# EAGLE design tlc-matrix-controller (EAGLE 5.10)
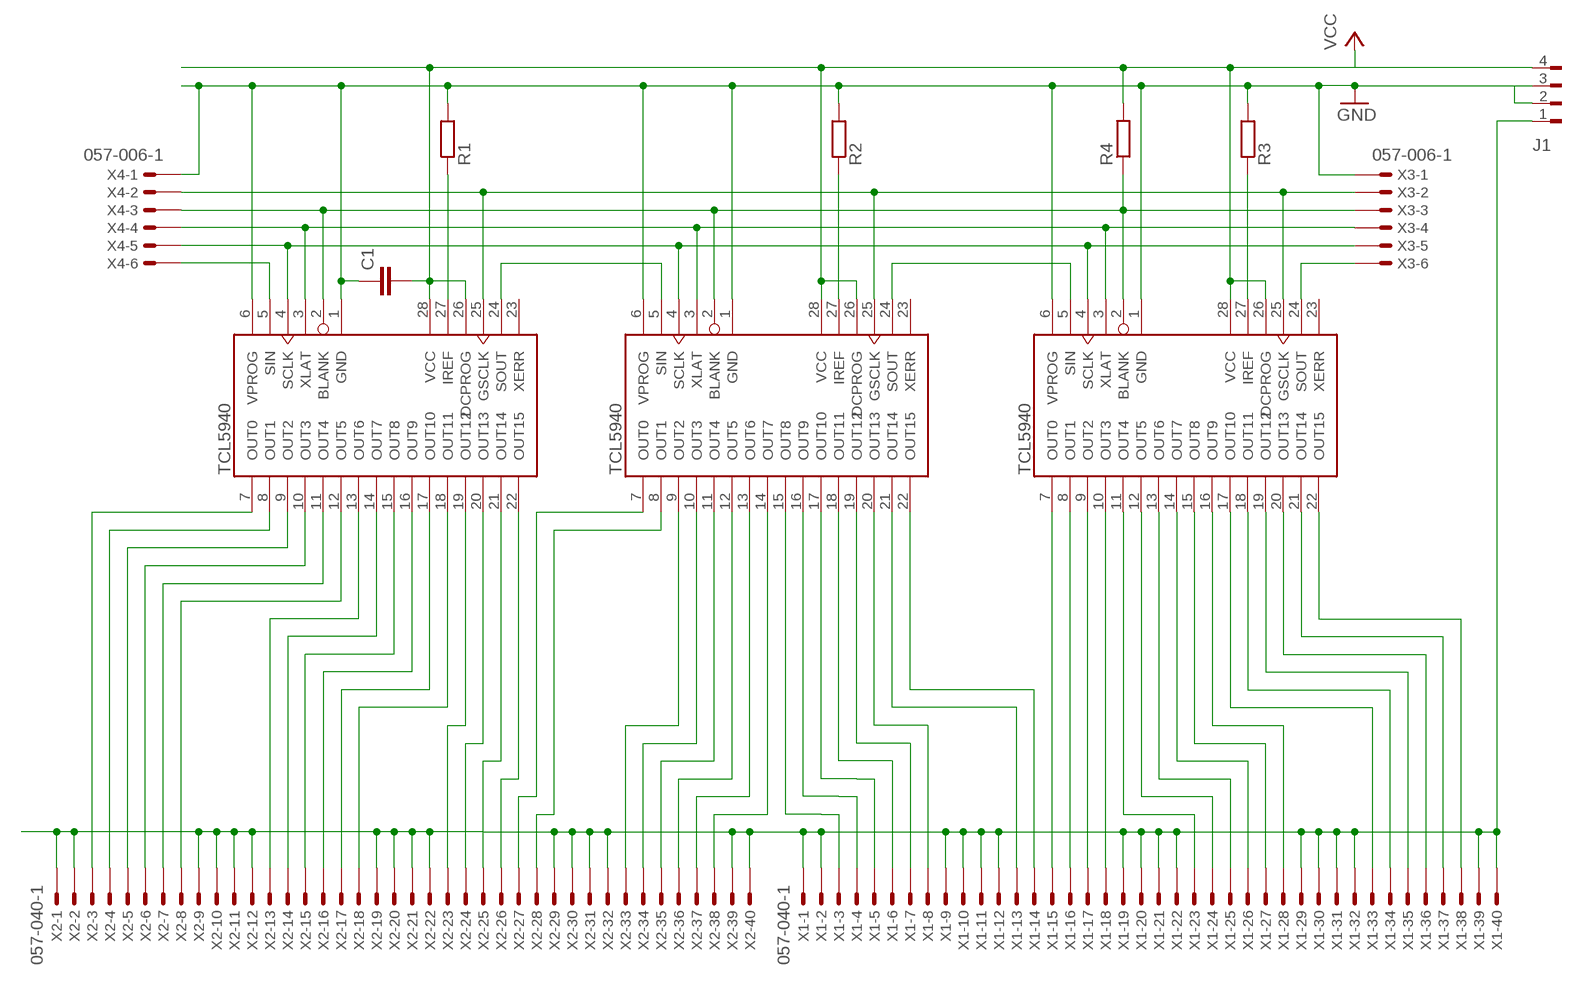
[diagram p0: schematic, sheet 1]

## Parts
C1  C-EU075-032X103  [C075-032X10-BIGPAD]
IC1  TCL5940  [PW_R-PDSO-G28]
IC2  TCL5940  [PW_R-PDSO-G28]
IC3  TCL5940  [PW_R-PDSO-G28]
J1  FLOPPY-4350211  [350211]
R1  R-EU_0207/10  [0207/10-BIGPAD]
R2  R-EU_0207/10  [0207/10-BIGPAD]
R3  R-EU_0207/10  [0207/10-BIGPAD]
R4  R-EU_0207/10  [0207/10-BIGPAD]
X1  057-040-1  [057-040-1]
X2  057-040-1  [057-040-1]
X3  057-006-1  [057-006-1]
X4  057-006-1  [057-006-1]

## Nets
N$2: IC1.5(SIN) X4.6
N$3: IC2.24(SOUT) IC3.5(SIN)
N$5: IC2.8(OUT1) X2.28
N$7: IC1.3(XLAT) IC2.3(XLAT) IC3.3(XLAT) X3.4 X4.4
N$8: IC1.8(OUT1) X2.4
N$9: IC1.27(IREF) R1.1
N$10: IC2.27(IREF) R2.1
N$11: IC3.27(IREF) R3.1
N$12: IC1.9(OUT2) X2.5
N$13: IC2.10(OUT3) X2.34
N$14: IC2.15(OUT8) X1.3
N$15: IC1.11(OUT4) X2.7
N$16: IC1.12(OUT5) X2.8
N$18: IC1.14(OUT7) X2.14
N$19: IC1.15(OUT8) X2.15
N$20: IC1.16(OUT9) X2.16
N$21: IC1.17(OUT10) X2.17
N$22: IC2.16(OUT9) X1.4
N$23: IC2.17(OUT10) X1.5
N$24: IC1.18(OUT11) X2.18
N$25: IC1.21(OUT14) X2.25
N$26: IC2.13(OUT6) X2.37
N$27: IC1.20(OUT13) X2.24
N$28: IC1.19(OUT12) X2.23
N$29: IC3.8(OUT1) X1.16
N$30: C1.2 IC1.26(DCPROG) IC1.28(VCC) IC2.26(DCPROG) IC2.28(VCC) IC3.26(DCPROG) IC3.28(VCC) J1.4 R4.2 ; supply symbol labelled VCC
N$31: IC2.9(OUT2) X2.33
N$33: IC2.11(OUT4) X2.35
N$34: IC2.12(OUT5) X2.36
N$35: IC3.9(OUT2) X1.17
N$36: IC2.14(OUT7) X2.38
N$37: IC2.18(OUT11) X1.6
N$38: IC2.19(OUT12) X1.7
N$39: IC2.20(OUT13) X1.8
N$40: IC2.21(OUT14) X1.13
N$41: IC3.10(OUT3) X1.18
N$42: IC2.22(OUT15) X1.14
N$43: IC1.22(OUT15) X2.26
N$44: IC1.2(BLANK) IC2.2(BLANK) IC3.2(BLANK) R4.1 X3.3 X4.3
N$45: IC2.7(OUT0) X2.27
N$46: IC3.7(OUT0) X1.15
N$47: IC3.11(OUT4) X1.23
N$48: IC3.12(OUT5) X1.24
N$49: IC3.13(OUT6) X1.25
N$50: IC3.14(OUT7) X1.26
N$51: IC3.15(OUT8) X1.27
N$53: IC3.17(OUT10) X1.33
N$55: IC3.19(OUT12) X1.35
N$56: IC3.20(OUT13) X1.36
N$57: IC3.21(OUT14) X1.37
N$58: IC3.22(OUT15) X1.38
N$59: C1.1 IC1.1(GND) IC1.6(VPROG) IC2.1(GND) IC2.6(VPROG) IC3.1(GND) IC3.6(VPROG) J1.2 J1.3 R1.2 R2.2 R3.2 X3.1 X4.1 ; supply symbol labelled GND
N$60: IC1.4(SCLK) IC2.4(SCLK) IC3.4(SCLK) X3.5 X4.5
N$64: IC1.24(SOUT) IC2.5(SIN)
N$67: J1.1 X1.1 X1.2 X1.9 X1.10 X1.11 X1.12 X1.19 X1.20 X1.21 X1.22 X1.29 X1.30 X1.31 X1.32 X1.39 X1.40 X2.1 X2.2 X2.9 X2.10 X2.11 X2.12 X2.19 X2.20 X2.21 X2.22 X2.29 X2.30 X2.31 X2.32 X2.39 X2.40
N$68: IC3.24(SOUT) X3.6
N$70: IC3.16(OUT9) X1.28
N$71: IC3.18(OUT11) X1.34
N$72: IC1.10(OUT3) X2.6
N$73: IC1.25(GSCLK) IC2.25(GSCLK) IC3.25(GSCLK) X3.2 X4.2
N$75: IC1.13(OUT6) X2.13
N$76: IC1.7(OUT0) X2.3
Unconnected: IC1.23(XERR) IC2.23(XERR) IC3.23(XERR)

## Library data of the parts
C1 = resistor:C-EU: CAPACITOR, European symbol
IC1-IC3 = tcl5940smd:TCL5940: 16-Channel 12-Bit LED Driver
J1 = con-amp:FLOPPY-4: MATE N-LOCK Floppy / HDD conector Distributor: Bürklin 71F970
R1-R4 = resistor:R-EU_: RESISTOR, European symbol
X1 X2 = con-panduit:057-040-: CONNECTOR 40-pin series 057 contact pc board low profile headers
X3 X4 = con-panduit:057-006-: CONNECTOR 6-pin series 057 contact pc board low profile headers

## Board
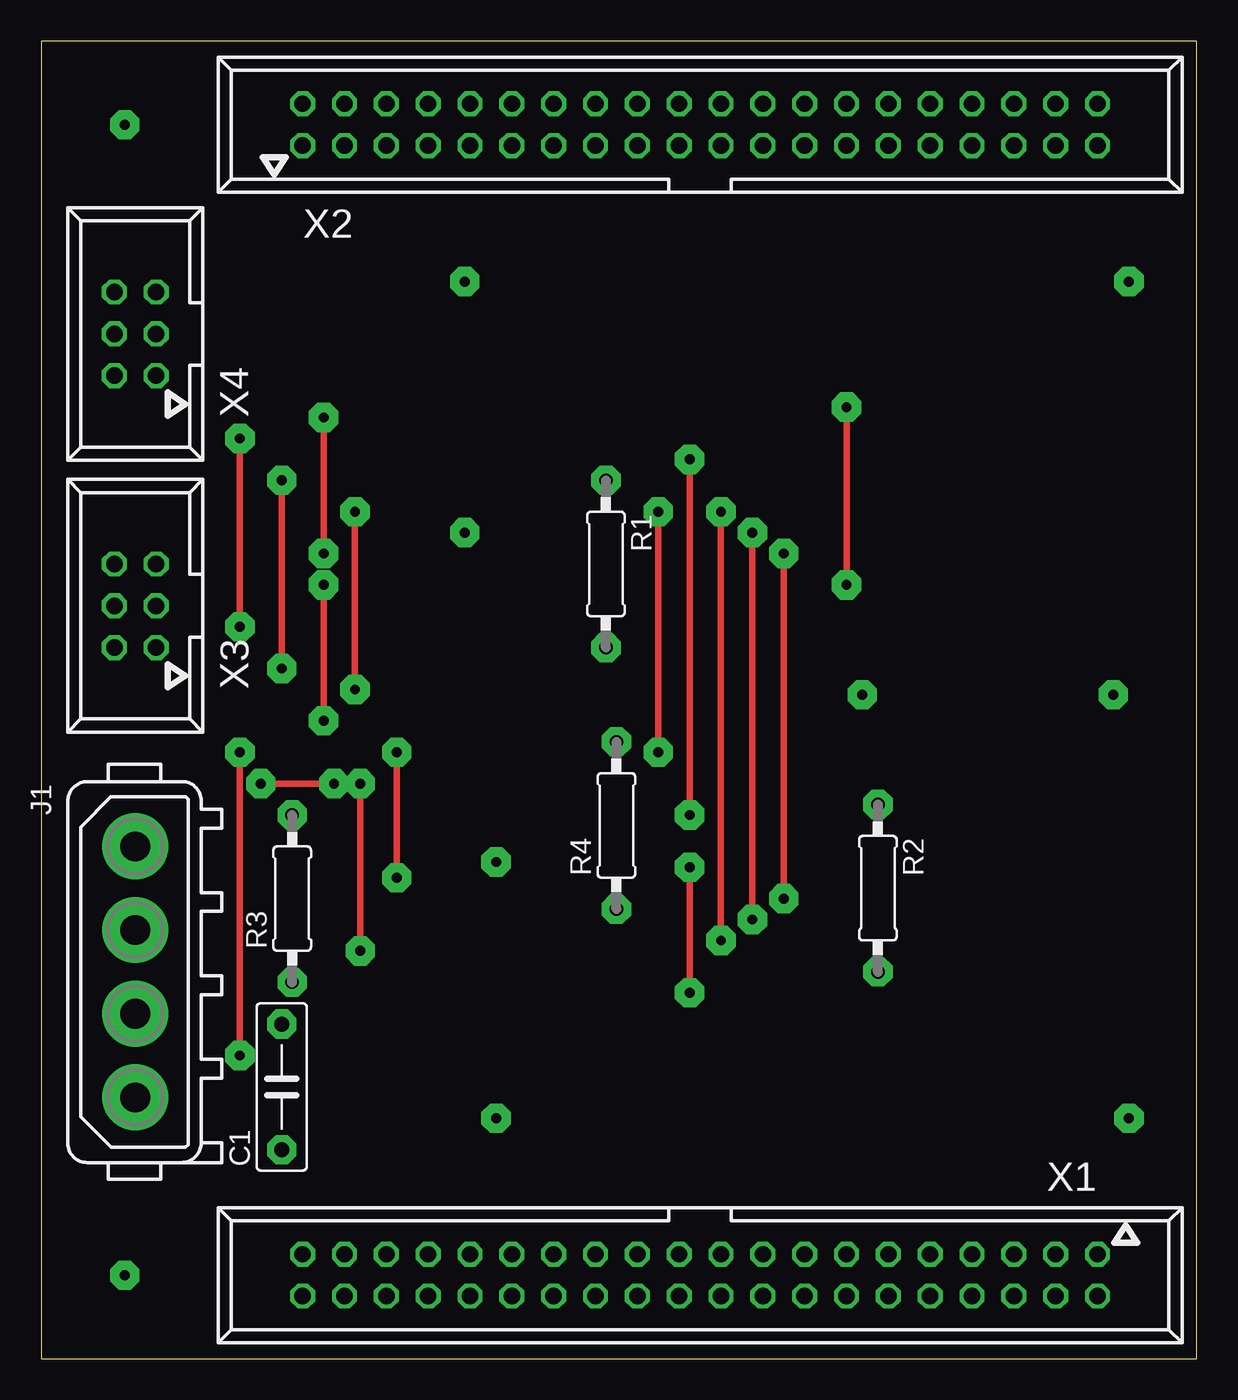
[diagram p1: board, top side]
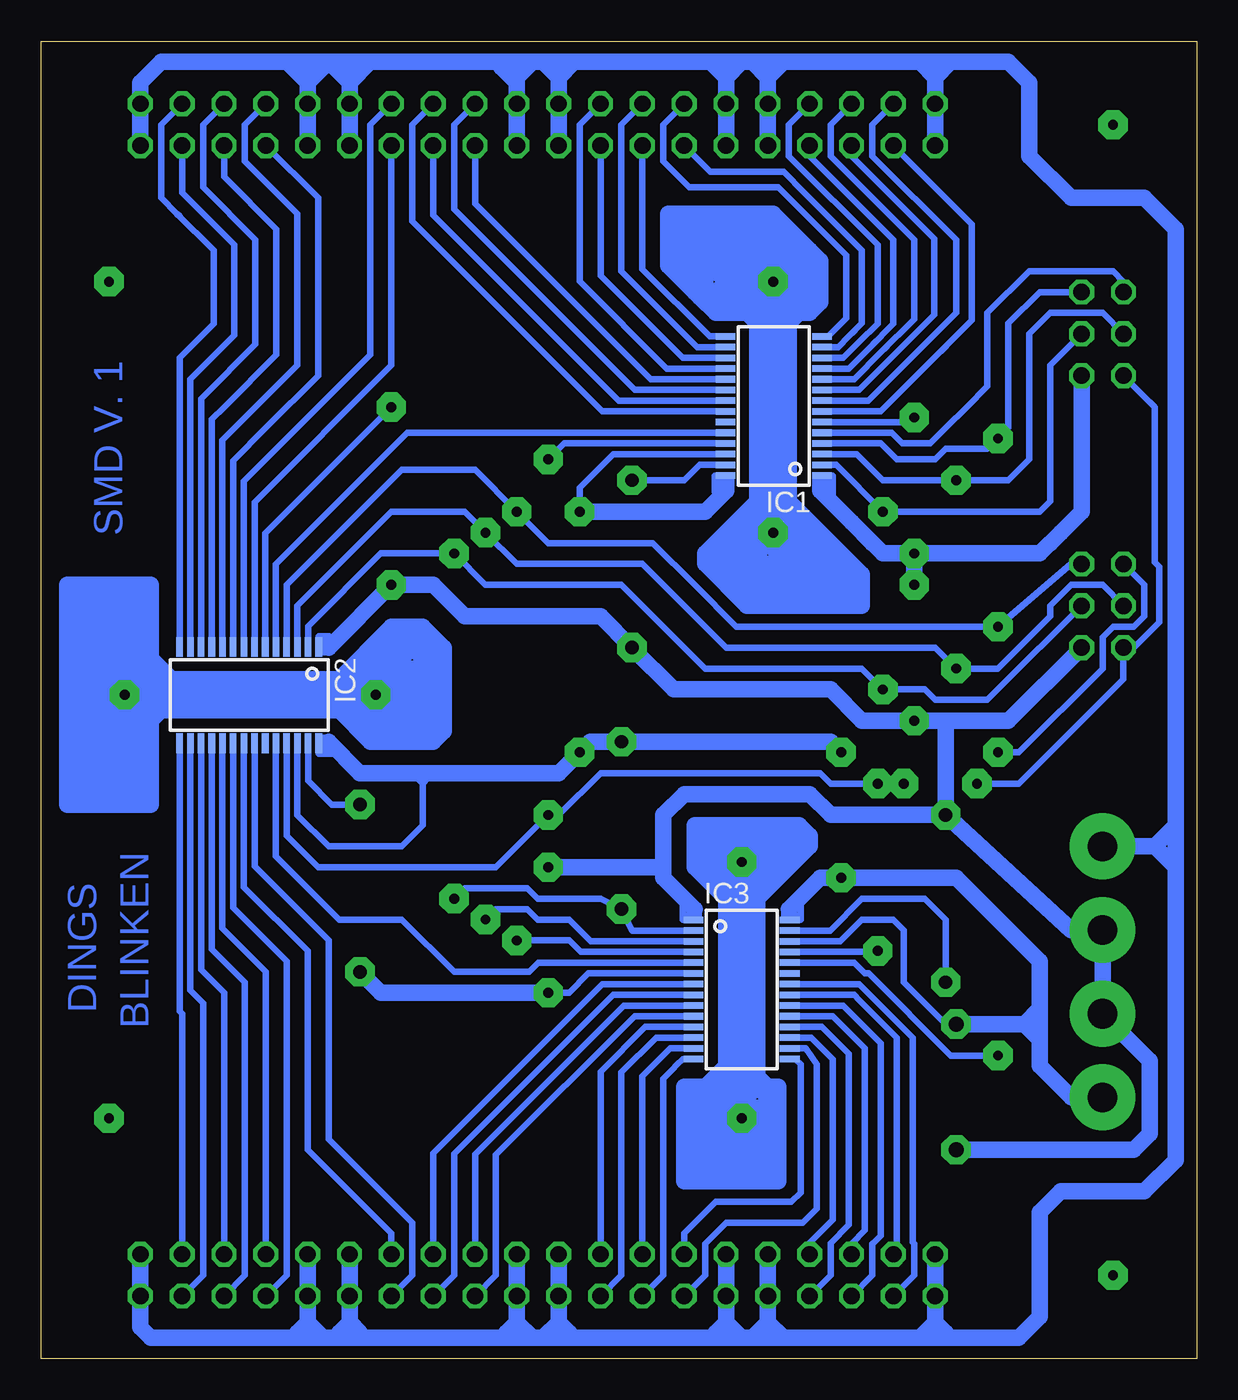
[diagram p2: board, bottom side, seen from below]

Size 70.16 x 80 mm. Coordinates in mm from the lower left corner, seen from the top.
Outline: 0,0 70.16,0 70.16,80 0,80 0,0
Copper layers (1*16): Top 0.035mm / dielectric 1.5mm / Bottom 0.035mm
Design rules "default": minimum track width 10mil, minimum drill 24mil, track to track 8mil, track to pad 8mil, pad to pad 8mil, via to via 8mil, smd to smd 8mil, copper to edge 40mil, drill to drill 8mil, minimum pad ring 10mil, minimum via ring 8mil, stop-mask expansion 4mil, vias tented up to drill 0mil, thermal gap 10mil

### Footprints (pad centres in the part's own frame; a part is rotated, then mirrored left to right if it is on the bottom)
C075-032X10-BIGPAD = drill 0.914 pad 1.778 octagon: 1 -3.81,0; 2 3.81,0
PW_R-PDSO-G28 = smd 0.4 x 1.2: 1 -4.225,-2.925; 2 -3.575,-2.925; 3 -2.925,-2.925; 4 -2.275,-2.925; 5 -1.625,-2.925; 6 -0.975,-2.925; 7 -0.325,-2.925; 8 0.325,-2.925; 9 0.975,-2.925; 10 1.625,-2.925; 11 2.275,-2.925; 12 2.925,-2.925; 13 3.575,-2.925; 14 4.225,-2.925; 15 4.225,2.925; 16 3.575,2.925; 17 2.925,2.925; 18 2.275,2.925; 19 1.625,2.925; 20 0.975,2.925; 21 0.325,2.925; 22 -0.325,2.925; 23 -0.975,2.925; 24 -1.625,2.925; 25 -2.275,2.925; 26 -2.925,2.925; 27 -3.575,2.925; 28 -4.225,2.925
350211 = drill 1.8 pad 4 round: 1 -7.62,0; 2 -2.54,0; 3 2.54,0; 4 7.62,0
0207/10-BIGPAD = drill 0.813 pad 1.778 octagon: 1 -5.08,0; 2 5.08,0
057-040-1 = drill 1 octagon: 1 -24.13,-1.27; 2 -24.13,1.27; 3 -21.59,-1.27; 4 -21.59,1.27; 5 -19.05,-1.27; 6 -19.05,1.27; 7 -16.51,-1.27; 8 -16.51,1.27; 9 -13.97,-1.27; 10 -13.97,1.27; 11 -11.43,-1.27; 12 -11.43,1.27; 13 -8.89,-1.27; 14 -8.89,1.27; 15 -6.35,-1.27; 16 -6.35,1.27; 17 -3.81,-1.27; 18 -3.81,1.27; 19 -1.27,-1.27; 20 -1.27,1.27; 21 1.27,-1.27; 22 1.27,1.27; 23 3.81,-1.27; 24 3.81,1.27; 25 6.35,-1.27; 26 6.35,1.27; 27 8.89,-1.27; 28 8.89,1.27; 29 11.43,-1.27; 30 11.43,1.27; 31 13.97,-1.27; 32 13.97,1.27; 33 16.51,-1.27; 34 16.51,1.27; 35 19.05,-1.27; 36 19.05,1.27; 37 21.59,-1.27; 38 21.59,1.27; 39 24.13,-1.27; 40 24.13,1.27
057-006-1 = drill 1 octagon: 1 -2.54,-1.27; 2 -2.54,1.27; 3 0,-1.27; 4 0,1.27; 5 2.54,-1.27; 6 2.54,1.27

### Placement (x,y rotation side)
C1  14.61,16.51 90 top
IC1  25.68,57.85 90 bottom
IC2  57.52,40.3 180 bottom
IC3  27.62,22.43 270 bottom
J1  5.71,23.5 270 top
R1  34.29,48.26 270 top
R2  50.8,28.57 270 top
R3  15.24,27.94 90 top
R4  34.92,32.38 90 top
X1  40.01,5.08 180 top
X2  40.01,74.93 0 top
X3  5.71,45.72 90 top
X4  5.71,62.23 90 top

### Tracks (layer width: path | path; a pad name or v marks a point on that pad's centre or on a via)
N$1
  Bottom 0.406: 29.25,52.65 29.25,53.62
N$2
  Bottom 0.406: 18.52,56.23 19.5,56.23 | 19.5,56.23 19.82,56.23 19.5,56.23 | 19.98,56.23 IC1.5 18.52,56.23 | X4.6 4.45,65.41 5.08,66.04 9.53,66.04 10.16,66.04 12.7,63.5 12.7,59.05 13.97,57.78 15.24,56.52 16.18,55.58 16.25,55.58 17.88,55.58 18.52,56.23
N$3
  Bottom 0.406: IC2.24 55.9,33.15 55.9,30.5 52.07,26.67 48.26,26.67 45.09,23.5 40.64,23.5 40.53,23.5 39.98,24.05 IC3.5
N$4
  Bottom 0.406: 22.1,52.98 22.1,53.62 | 22.1,52.98 22.1,52.65 22.1,52.98 | 22.1,52.98 22.1,53.22 22.23,53.34 22.23,52.7 | 22.1,52.98 22.1,52.33
N$5
  Bottom 0.406: X2.28 50.16,74.93 50.16,73.03 50.16,60.96 57.85,53.27 57.85,43.55 IC2.8
N$6
  Bottom 0.406: 53.3,42.9 52.65,42.9 52.65,43.55 53.3,43.55 53.3,43.88 52.65,43.88
N$7  (via drill 0.6 pad 1.78)
  Top 0.406: v43.18,50.16 v43.18,26.67 | v14.61,41.91 v14.61,53.34
  Bottom 0.406: X4.4 5.71,63.5 8.89,63.5 10.16,62.23 10.16,54.61 11.43,53.34 v14.61,53.34 19.05,53.34 20.64,54.92 IC1.3 | IC3.3 36.78,25.35 38.1,26.67 40.01,26.67 40.64,27.3 42.55,27.3 v43.18,26.67 | X3.4 5.71,46.99 7.62,46.99 8.89,45.72 8.89,45.09 12.06,41.91 v14.61,41.91 15.88,43.18 28.57,43.18 33.66,48.26 41.27,48.26 v43.18,50.16 44.45,51.44 48.9,51.44 54.6,45.73 IC2.3
N$8
  Bottom 0.406: X2.4 19.68,74.93 19.68,73.03 14.61,67.94 14.61,63.82 | 14.61,63.82 14.61,63.72 | IC1.8 19.93,58.17 14.61,63.5 14.61,63.82
N$9
  Bottom 0.406: IC1.27 30.18,54.27 31.11,53.34 R1.1
N$10
  Bottom 0.406: IC2.27 53.95,35.1 52.51,33.66 R2.1
N$11
  Bottom 0.406: IC3.27 23.53,26 IC3.27 | 16.51,27.94 15.88,27.3 | 16.51,27.94 20.32,27.94 22.26,26 IC3.27 | R3.1 15.24,26.67 16.51,27.94
N$12
  Bottom 0.406: 20.8,58.83 IC1.9 | 20.8,58.83 20.55,58.83 | X2.5 20.95,73.03 19.37,71.44 16.19,68.26 15.93,68 15.93,63.38 20.48,58.83 20.8,58.83
N$13
  Bottom 0.406: 58.1,56.83 59.15,55.78 59.15,43.55 IC2.10 | 58.1,56.83 57.78,57.15 | X2.34 57.78,74.93 57.78,73.03 57.78,72.71 54.61,69.53 54.61,60.33 58.1,56.83
N$14
  Bottom 0.406: IC2.15 61.75,21.11 61.59,20.95 X1.3
N$15
  Bottom 0.406: IC1.11 21.12,60.12 19.82,61.42 | 19.82,61.42 19.5,61.75 | X2.7 23.5,73.03 18.41,67.94 18.41,62.84 19.82,61.42
N$16
  Bottom 0.406: X2.8 24.77,74.93 24.77,73.03 19.37,67.63 19.37,62.86 20.48,61.75 | IC1.12 21.45,60.77 20.48,61.75 | 20.48,61.75 20.15,62.08
N$17
  Bottom 1.016: 26.67,19.05 26.67,26.04 | 26.67,19.05 26.67,27.94 23.5,31.11 23.5,31.75 24.13,32.38 30.48,32.38 30.48,29.84 28.57,27.94 28.57,19.05 | 28.57,19.05 27.94,19.68 27.94,28.57 29.21,29.84 29.84,29.84 29.84,31.75 24.13,31.75 27.3,28.57 29.21,30.48 29.21,31.11 25.4,31.11 27.3,29.21 28.57,30.48 27.3,30.48 26.67,30.48 27.3,29.84 27.3,19.68 | 26.67,19.05 26.67,17.14 26.04,16.51 25.4,16.51 25.4,10.79 31.11,10.79 31.11,16.51 29.84,16.51 28.57,17.78 28.57,19.05 | 28.57,19.05 27.3,19.05 27.3,15.88 26.67,16.51 26.04,15.88 26.04,11.43 30.48,11.43 30.48,15.88 29.21,15.88 27.94,17.14 27.94,17.78 27.94,18.41 27.94,12.06 29.84,12.06 29.84,15.24 28.57,15.24 28.57,13.97 29.21,13.34 29.21,12.7
N$18
  Bottom 0.406: X2.14 32.38,74.93 32.38,73.03 32.38,72.71 30.8,71.12 25.4,71.12 21.27,66.99 21.27,63.5 | 22.38,62.08 IC1.14 22.38,62.08 | 21.27,63.5 21.27,63.23 | 22.38,62.08 21.27,63.18 21.27,63.5
N$19
  Bottom 0.406: X2.15 33.66,66.16 29.57,62.08 IC1.15
N$20
  Bottom 0.406: X2.16 34.92,74.93 34.92,73.03 34.92,66.04 30.31,61.42 IC1.16
N$21
  Bottom 0.406: X2.17 36.2,65.77 31.2,60.77 IC1.17
N$22
  Bottom 0.406: X1.4 60.33,5.08 60.33,6.99 60.33,21.59 61.1,22.36 IC2.16
N$23
  Bottom 0.406: IC2.17 60.45,23.62 59.05,22.23 X1.5
N$24
  Bottom 0.406: X2.18 37.47,74.93 37.47,73.03 37.47,65.42 32.17,60.12 IC1.18
N$25
  Bottom 0.406: X2.25 46.35,69.43 35.1,58.17 IC1.21
N$26
  Bottom 0.406: IC2.13 61.1,59.48 58.42,62.16 58.42,67.63 61.59,70.8 X2.37 61.59,72.39
N$27
  Bottom 0.406: X2.24 45.09,74.93 45.09,73.03 45.09,69.78 34.12,58.83 IC1.20
N$28
  Bottom 0.406: X2.23 43.81,70.14 33.15,59.48 IC1.19
N$29
  Bottom 0.406: X1.16 45.09,5.08 45.09,6.99 45.09,12.44 35.42,22.1 IC3.8
N$30  (via drill 0.6 pad 1.78)
  Top 0.406: v37.47,36.83 v37.47,51.44 | v21.59,29.21 v21.59,36.83
  Bottom 0.406: 54.6,34.45 54.6,33.01 52.7,31.11 48.26,31.11 46.99,32.38 46.99,34.92 | 54.6,34.45 54.6,34.77 | 28.6,53.37 IC1.28 28.6,53.37 | 28.6,53.37 28.57,53.34 28.6,53.37 | IC1.26 35.42,54.92 37.47,52.88 v37.47,51.44 | IC3.26 21.64,25.35 20.32,26.67 18.41,26.67 17.78,26.04 17.78,25.72 17.78,22.86 15.24,20.32 C1.2 | IC3.28 24.7,27.24 24.77,27.3 | IC2.28 52.8,37.38 52.7,37.47 | 54.6,35.75 54.6,34.91 | 54.6,35.75 IC2.26 | 53.3,37.7 52.94,37.7 52.7,37.47 | 52.7,37.47 52.7,37.1 52.65,37.05 53.3,37.05 53.3,36.73 52.33,36.73 | 46.99,35.56 46.99,34.92 | 54.6,34.45 54.6,35.75 | 46.99,34.92 47.31,35.24 46.99,34.92 | 46.99,34.92 46.67,35.24
  Bottom 1.016: 24.77,27.3 22.86,29.21 v21.59,29.21 | v21.59,29.21 20.95,29.21 v21.59,29.21 | 52.7,37.47 50.8,35.56 46.99,35.56 45.72,35.56 38.73,35.56 | 28.57,53.34 28.57,52.7 29.84,51.44 v37.47,51.44 | v37.47,36.83 38.73,35.56 | J1.4 7.62,15.88 9.53,17.78 9.53,19.37 | v21.59,29.21 14.61,29.21 9.53,24.13 9.53,21.27 | 9.53,19.37 9.53,20.32 | 9.53,20.32 9.53,21.27 | 9.53,20.32 10.48,20.32 | 10.48,20.32 C1.2 | v37.47,36.83 38.73,35.56 | v37.47,36.83 36.83,37.47 R4.2 22.23,37.47 v21.59,36.83 | 10.48,20.32 9.53,21.27 | 9.53,19.37 10.48,20.32
N$31
  Bottom 0.406: IC2.9 58.5,54.53 56.52,56.52 53.34,59.69 53.34,70.48 X2.33
N$32
  Bottom 1.016: 29.21,13.97 28.57,14.61 28.57,15.88 29.21,15.24 29.21,14.61 28.57,13.97 28.57,12.7 27.94,12.06 27.3,12.06 26.67,12.06 26.67,15.24 27.3,15.24 27.3,13.34 27.3,12.7
N$33
  Bottom 0.406: IC2.11 59.8,57.04 59.05,57.78 55.88,60.96 55.88,68.58 59.05,71.75 X2.35
N$34
  Bottom 0.406: X2.36 60.33,74.93 60.33,73.03 60.33,71.44 60.33,71.12 57.15,67.94 57.15,61.59 60.33,58.42 60.45,58.3 IC2.12
N$35
  Bottom 0.406: X1.17 43.81,12.41 34.77,21.45 IC3.9
N$36
  Bottom 0.406: X2.38 62.87,74.93 62.87,73.03 62.87,70.48 61.91,69.53 | IC2.14 61.75,60.77 59.69,62.84 59.69,67.31 61.91,69.53 | 61.91,69.53 61.75,69.37
N$37
  Bottom 0.406: X1.6 57.78,5.08 57.78,6.99 57.78,22.86 59.8,24.88 IC2.18
N$38
  Bottom 0.406: IC2.19 59.15,26.13 56.52,23.5 X1.7
N$39
  Bottom 0.406: X1.8 55.24,5.08 55.24,6.99 55.24,24.13 58.5,27.39 IC2.20
N$40
  Bottom 0.406: IC2.21 57.85,28.64 53.98,24.77 53.98,12.7 48.9,7.62 X1.13
N$41
  Bottom 0.406: X1.18 42.55,5.08 42.55,6.99 42.55,12.38 34.12,20.8 IC3.10
N$42
  Bottom 0.406: X1.14 47.62,5.08 47.62,6.99 47.62,8.26 52.7,13.34 52.7,25.4 57.2,29.89 IC2.22
N$43
  Bottom 0.406: X2.26 47.62,74.93 47.62,73.03 47.62,69.08 36.08,57.52 IC1.22
N$44  (via drill 0.6 pad 1.78)
  Top 0.406: v45.09,48.9 v45.09,27.94 | v19.05,40.64 v19.05,51.44
  Bottom 0.406: 38.73,27.94 39.37,27.94 40.01,27.94 40.64,28.57 44.45,28.57 v45.09,27.94 | 38.73,27.94 38.1,27.94 | X4.3 8.89,60.33 8.89,55.88 8.89,55.24 8.89,52.07 9.53,51.44 v19.05,51.44 21.89,54.27 IC1.2 | X3.3 12.06,40.64 12.7,40.01 15.88,40.01 16.51,40.64 v19.05,40.64 20.32,41.91 29.84,41.91 34.92,46.99 43.18,46.99 v45.09,48.9 49.53,48.9 53.95,44.48 IC2.2 | IC3.2 34.26,26 R4.1 36.2,27.94 38.73,27.94
N$45
  Bottom 0.406: IC2.7 57.2,52.02 48.9,60.33 X2.27
N$46
  Bottom 0.406: X1.15 46.35,12.47 36.08,22.75 IC3.7
N$47
  Bottom 0.406: X1.23 36.2,17.43 33.48,20.15 IC3.11
N$48
  Bottom 0.406: X1.24 34.92,5.08 34.92,6.99 34.92,17.4 32.83,19.5 IC3.12
N$49
  Bottom 0.406: IC3.13 31.95,18.85 33.66,17.14 X1.25
N$50
  Bottom 0.406: X1.26 32.38,5.08 32.38,6.99 32.38,9.53 32.38,17.02 32.17,17.23 31.85,17.55 31.52,17.88 31.2,18.2 IC3.14
N$51
  Bottom 0.406: IC3.15 24.38,18.2 24.05,17.88 24.05,11.38 24.05,10.07 24.6,9.53 29.21,9.53 31.11,7.62 X1.27
N$52  (via drill 0.6 pad 1.78)
  Bottom 1.016: 24.77,62.23 24.77,52.07 20.32,47.62 20.32,45.72 27.3,45.72 29.84,48.26 29.84,48.9 26.67,52.07 26.67,57.78 | 26.04,57.78 26.67,57.78 | 26.04,57.78 25.4,57.78 25.4,51.44 20.95,46.99 20.95,46.35 21.59,46.35 | 21.59,46.35 27.3,46.35 29.21,48.26 26.04,51.44 | 26.04,51.44 22.23,47.62 | 22.23,47.62 22.23,46.99 26.67,46.99 27.94,48.26 28.57,48.26 26.67,50.16 26.04,50.16 23.5,47.62 24.13,47.62 | 24.13,47.62 26.04,47.62 26.67,48.26 27.3,48.26 26.67,48.9 26.04,49.53 25.4,48.9 25.4,48.26 26.04,48.26 25.4,47.62 24.13,47.62 | 24.13,47.62 22.23,47.62 | 26.04,51.44 22.23,47.62 | 26.04,51.44 26.04,52.07 26.04,57.15 | 26.67,57.78 26.67,62.87 | 26.67,62.87 27.3,63.5 28.57,63.5 29.21,63.5 30.16,64.45 | 30.16,64.45 30.48,64.77 30.48,67.31 23.5,67.31 22.86,66.67 | 22.86,66.67 22.86,64.14 23.5,63.5 24.13,63.5 24.77,62.87 | 24.77,62.87 24.77,62.23 | 24.77,62.23 25.4,61.59 25.4,58.42 26.04,59.05 26.04,62.23 26.67,62.87 | 26.67,63.5 26.67,62.87 | 26.67,63.5 26.67,64.14 29.21,64.14 29.84,64.77 29.84,65.41 29.84,66.67 23.5,66.67 23.5,64.14 24.77,62.87 | 25.4,62.87 24.77,62.87 | 25.4,62.87 25.4,62.23 26.67,63.5 | 26.04,64.14 26.67,63.5 | 26.04,64.14 26.04,64.77 | 26.04,64.77 27.3,64.77 27.94,65.41 28.57,65.41 29.21,64.77 27.94,64.77 29.21,66.04 24.13,66.04 24.13,64.14 25.4,62.87 | 25.4,62.87 26.04,63.5 24.77,64.77 | 24.77,64.77 24.77,65.41 v25.72,65.41 | v25.72,65.41 26.67,65.41 26.04,64.77 | 26.04,64.14 26.04,64.77 | 26.04,64.14 25.4,64.77 24.77,64.77 | 24.77,64.77 25.4,65.41 v25.72,65.41 | v25.72,65.41 27.3,65.41 26.04,64.14 | 26.04,57.78 26.04,64.14 | 24.13,47.62 24.77,48.26 | 24.13,47.62 22.86,46.35 21.59,46.35
  Bottom 1.016: 21.59,46.35 21.59,46.99 | 22.86,66.67 25.72,69.53 32.07,69.53 32.07,66.36 30.16,64.45
N$53
  Bottom 0.406: IC3.17 23.4,19.5 22.1,18.2 22.1,11.38 22.1,8.45 23.5,7.05 X1.33
N$54
  Bottom 1.016: 54.61,41.27 55.24,41.27 | 54.61,41.27 52.07,41.27 48.9,44.45 46.99,44.45 45.72,43.18 45.72,38.1 46.35,37.47 50.16,37.47 52.07,39.37 52.7,39.37 60.33,39.37 | 60.33,39.37 60.33,41.27 59.05,41.27 | 59.05,41.27 54.61,41.27 | 54.61,41.27 50.8,41.27 48.26,43.81 46.99,43.81 46.35,43.18 46.35,38.1 50.16,38.1 50.8,38.73 | 50.8,38.73 51.44,39.37 51.44,40.64 50.16,40.64 47.62,43.18 46.99,42.55 46.99,38.73 50.8,38.73 | 50.8,38.73 50.8,39.37 50.16,40.01 50.8,40.01 48.9,41.91 47.62,41.91 47.62,39.37 50.16,39.37 48.9,40.64 48.26,41.27 48.26,40.01 48.9,40.01 59.69,40.01 59.69,40.64 52.07,40.64 | 59.05,41.27 62.23,41.27 63.5,42.55 63.5,43.18 63.5,46.35 | 63.5,46.35 64.14,46.99 65.41,46.99 | 65.41,46.99 68.58,46.99 68.58,34.29 68.58,33.66 63.5,33.66 63.5,34.29 63.5,38.73 62.87,39.37 62.23,39.37 60.33,39.37 | 60.33,39.37 60.96,40.01 60.96,40.64 | 63.5,46.35 63.5,46.99 65.41,46.99
N$55
  Bottom 0.406: IC3.19 22.1,20.8 21.45,20.15 20.15,18.85 20.15,11.38 20.15,7.8 20.95,7 X1.35
N$56
  Bottom 0.406: IC3.20 21.45,21.45 19.18,19.18 19.18,11.38 19.18,7.47 19.66,6.99 19.68,6.99 19.68,5.08 X1.36
N$57
  Bottom 0.406: IC3.21 20.8,22.1 20.48,21.77 18.2,19.5 18.2,15.93 18.2,6.83 18.41,6.61 X1.37
N$58
  Bottom 0.406: IC3.22 20.48,22.75 17.23,19.5 17.23,16.9 17.23,10.4 17.23,7.07 17.14,6.99 17.14,5.08 X1.38
N$59  (via drill 0.6 pad 1.78)
  Top 0.406: v17.14,48.9 v17.14,57.15 | v17.14,38.73 v17.14,46.99 | v39.37,29.84 v39.37,22.23 | v48.9,46.99 v48.9,57.78
  Bottom 0.406: 17.55,56.88 19.18,56.88 | 19.18,56.88 IC1.6 | IC1.1 22.75,53.45 22.86,53.34 | IC3.1 30.55,27.23 30.48,27.3 | IC3.6 36.73,23.4 36.92,23.4 38.1,22.23 v39.37,22.23 49.53,22.23 R2.2 | IC2.6 56.55,50.13 v48.9,57.78 | IC2.1 52.75,43.23 52.7,43.18 | 17.55,56.88 19.18,56.88 | 17.55,56.88 17.27,57.15 v17.14,57.15
  Bottom 1.016: 30.48,27.3 32.38,29.21 32.38,29.84 | 32.38,29.84 32.38,33.02 31.11,34.29 23.5,34.29 22.23,33.02 R3.2 | 52.7,43.18 v48.9,46.99 46.35,46.99 44.45,45.09 36.2,45.09 R1.2 31.75,40.64 22.23,40.64 20.32,38.73 v17.14,38.73 15.24,38.73 | X4.1 6.99,51.44 8.26,50.16 | 8.26,50.16 8.89,49.53 | 22.86,53.34 22.86,52.7 20.95,50.8 | 20.95,50.8 19.68,49.53 | X3.1 11.43,38.73 15.24,38.73 | v17.14,46.99 v17.14,48.9 | C1.1 3.81,12.7 2.86,13.65 2.86,18.1 J1.3 J1.2 7.62,26.04 R3.2 | 32.38,29.84 v39.37,29.84 | R3.2 15.24,38.73 | v17.14,48.9 9.53,48.9 8.26,50.16 | v17.14,48.9 19.05,48.9 20.95,50.8 | v39.37,22.23 49.53,22.23 R2.2
N$60  (via drill 0.6 pad 1.78)
  Top 0.406: v41.27,51.44 v41.27,25.4 | v12.06,44.45 v12.06,55.88
  Bottom 0.406: IC3.4 37.4,24.7 38.1,25.4 v41.27,25.4 | 19.5,55.58 19.36,55.58 | 19.5,55.58 IC1.4 | X4.5 9.53,64.77 11.43,62.87 11.43,56.52 v12.06,55.88 12.7,55.24 13.34,55.24 15.24,55.24 15.88,54.61 17.78,54.61 18.21,54.61 19.18,55.58 19.5,55.58 | X3.5 7.62,48.26 v12.06,44.45 27.94,44.45 30.48,46.99 33.02,49.53 39.37,49.53 v41.27,51.44 43.81,53.98 48.26,53.98 50.8,51.44 55.25,46.98 IC2.4
N$61
  Bottom 0.406: 30.23,26.65 30.23,27.3
N$62
  Bottom 0.406: 30.88,26.65 30.88,26.98
N$63
  Bottom 0.406: 31.2,26.65 31.2,27.3 31.2,27.62
N$64
  Bottom 0.406: IC1.24 31.2,56.23 | 31.2,56.23 31.46,56.23 | IC2.5 55.9,48.24 48.26,55.88 47.91,56.23 31.52,56.23 31.2,56.23
N$65
  Bottom 1.016: 61.59,40.64 67.94,40.64 67.94,40.01 61.59,40.01
N$66
  Bottom 1.016: 64.14,38.73 64.14,39.37 | 64.14,38.73 63.5,39.37 64.14,38.73 | 64.14,34.92 64.14,38.73 | 64.14,34.92 64.14,34.29 67.94,34.29 67.94,46.35 64.14,46.35 64.14,45.72 | 64.14,45.72 64.14,34.92 | 64.14,34.92 63.5,35.56 63.5,41.27 67.31,41.27 67.31,45.72 64.14,45.72 | 64.77,45.09 64.14,45.72 | 64.77,45.09 65.41,44.45 65.41,34.92 64.77,34.92 64.77,45.09 | 64.77,45.09 66.67,45.09 67.31,44.45 67.31,34.92 66.67,34.92 | 66.67,34.92 66.04,34.92 66.04,44.45 66.67,44.45 66.67,34.92
N$67
  Bottom 0.406: X1.40 X1.39
  Bottom 1.016: 1.27,32.38 2.54,31.11 | 1.27,32.38 1.27,68.58 3.17,70.48 7.62,70.48 10.16,73.03 10.16,77.47 11.43,78.74 14.92,78.74 | 14.92,78.74 15.88,78.74 | 15.88,78.74 16.83,78.74 | 16.83,78.74 25.08,78.74 | 25.08,78.74 26.04,78.74 | 26.04,78.74 26.99,78.74 | 26.99,78.74 27.62,78.74 | 27.62,78.74 28.57,78.74 | 28.57,78.74 29.53,78.74 | 29.53,78.74 37.78,78.74 | 37.78,78.74 38.73,78.74 | 38.73,78.74 39.69,78.74 | 39.69,78.74 40.32,78.74 | 40.32,78.74 41.27,78.74 | 41.27,78.74 50.16,78.74 | 50.16,78.74 51.44,78.74 | 51.44,78.74 52.7,78.74 | 52.7,78.74 53.98,78.74 | 28.57,78.74 28.57,77.79 | 28.57,77.79 X2.12 X2.11 | X2.19 X2.20 38.73,77.47 | 51.44,77.47 X2.30 X2.29 51.44,77.47 | 51.44,77.47 51.44,78.11 | X2.39 X2.40 64.14,77.47 62.87,78.74 55.24,78.74 | 53.98,78.74 55.24,78.74 | 15.88,78.74 15.88,77.79 | 15.88,77.79 X2.2 X2.1 | 26.04,78.74 26.04,77.79 | 26.04,77.79 X2.10 X2.9 | 41.27,78.74 41.27,78.11 41.27,77.79 | X2.21 X2.22 41.27,77.47 | 38.73,78.74 38.73,77.79 | 38.73,77.79 38.73,77.47 | 41.27,77.79 41.27,77.47 | 53.98,77.47 X2.32 X2.31 53.98,77.47 | 53.98,77.47 53.98,78.11 | 53.98,78.74 53.98,77.47 | 51.44,78.74 51.44,77.47 | X1.1 X1.2 64.14,1.91 63.5,1.27 53.98,1.27 | 51.44,1.27 53.02,1.27 | 53.02,1.27 53.98,1.27 | 15.88,1.27 16.83,1.27 | 16.83,1.27 25.08,1.27 | 25.08,1.27 26.04,1.27 | 26.04,1.27 26.99,1.27 | 26.99,1.27 27.62,1.27 | 27.62,1.27 28.57,1.27 | 28.57,1.27 38.73,1.27 | 38.73,1.27 39.69,1.27 | 39.69,1.27 40.32,1.27 | 40.32,1.27 41.27,1.27 | 41.27,1.27 51.44,1.27 | X1.9 X1.10 53.98,2.22 | 53.98,1.27 53.98,2.22 | X1.11 X1.12 51.44,2.22 | 51.44,1.27 51.44,2.22 | X1.19 X1.20 41.27,2.22 | 41.27,1.27 41.27,2.22 | X1.21 X1.22 38.73,2.22 | 38.73,1.27 38.73,2.22
  Bottom 1.016: X1.29 X1.30 28.57,2.22 | 28.57,1.27 28.57,2.22 | X1.31 X1.32 26.04,2.22 | 26.04,1.27 26.04,2.22 | 15.88,1.27 15.88,2.22 | 15.88,2.22 X1.40 X1.39 | 15.88,1.27 10.79,1.27 9.53,2.54 9.53,8.89 8.26,10.16 3.17,10.16 1.27,12.06 1.27,20.95 1.27,29.84 | 1.27,29.84 1.27,32.38 | 2.54,31.11 J1.1 | 1.27,29.84 2.54,31.11 | 53.98,77.47 53.02,78.42 | 51.44,77.47 52.7,78.74 | 50.16,78.74 51.44,77.47 | 55.24,78.74 53.98,77.47 | 41.27,77.47 42.23,78.42 | 40.32,78.74 41.27,77.79 | 38.73,77.79 38.73,77.47 | 38.73,77.79 39.69,78.74 | 37.78,78.74 38.73,77.79 | 27.62,78.74 28.57,77.79 | 28.57,77.79 29.53,78.74 | 26.04,77.79 26.99,78.74 | 25.08,78.74 26.04,77.79 | 15.88,77.79 16.83,78.74 | 14.92,78.74 15.88,77.79 | 15.88,2.22 15.24,1.59 | 16.83,1.27 15.88,2.22 | 25.08,1.27 26.04,2.22 | 26.04,2.22 26.99,1.27 | 27.62,1.27 28.57,2.22 | 28.57,2.22 29.21,1.59 | 38.73,2.22 38.1,1.59 | 39.69,1.27 38.73,2.22 | 40.32,1.27 41.27,2.22 | 41.27,2.22 41.91,1.59 | 51.44,2.22 50.8,1.59 | 51.44,2.22 52.07,1.59 | 53.02,1.27 53.98,2.22 | 53.98,2.22 54.61,1.59
N$68  (via drill 0.6 pad 1.78)
  Top 0.406: v12.06,18.41 v12.06,36.83
  Bottom 0.406: X3.6 3.17,46.99 3.17,45.09 3.81,44.45 5.08,44.45 5.71,43.81 5.71,41.91 10.79,36.83 v12.06,36.83 | 20.8,24.05 22.1,24.05 | 22.1,24.05 IC3.24 | 14.92,18.41 13.97,18.41 v12.06,18.41 14.92,18.41 | 20.8,24.05 22.1,24.05 | 20.8,24.05 20.15,23.4 19.91,23.4 14.92,18.41
N$69
  Bottom 0.406: 25.02,26.65 25.02,27.3 24.7,27.3 24.05,26.65 24.05,27.3 24.05,27.62
N$70
  Bottom 0.406: IC3.16 23.73,18.85 23.07,17.88 23.07,11.38 23.07,9.1 23.92,8.26 24.13,8.26 28.57,8.26 29.84,6.99 29.84,5.08 X1.28
N$71
  Bottom 0.406: IC3.18 22.75,20.15 21.12,18.52 21.12,11.38 21.12,8.12 22.23,7.03 22.23,6.99 22.23,5.08 X1.34
N$72
  Bottom 0.406: X2.6 22.1,75.06 22.23,74.93 22.23,73.03 17.14,67.94 17.14,66.36 17.14,63.13 19.18,61.1 | IC1.10 20.8,59.48 19.18,61.1 | 19.18,61.1 18.85,61.42
N$73  (via drill 0.6 pad 1.78)
  Top 0.406: v39.37,33.02 v39.37,54.61 | v19.37,24.77 v19.37,34.92 | v17.78,34.92 v13.34,34.92
  Bottom 0.406: 55.25,34.77 55.25,34.3 | 55.25,34.77 IC2.25 | 3.17,58.42 X4.2 | 2.86,44.13 3.81,43.18 X3.2 4.45,41.27 10.16,35.56 10.79,34.92 v13.34,34.92 | 2.86,44.13 2.54,44.45 | 2.54,56.2 2.54,48.58 2.54,48.37 2.27,48.1 2.27,44.85 2.27,44.72 2.54,44.45 | 2.54,56.2 2.54,56.52 | IC3.25 21.12,24.7 21.02,24.7 20.07,24.7 v19.37,24.77 | v17.78,34.92 v19.37,34.92 22.23,34.92 22.86,35.56 36.2,35.56 38.73,33.02 v39.37,33.02 40.64,31.75 | 40.64,31.75 41.27,31.11 | IC1.25 38.41,55.58 v39.37,54.61 | 55.25,33.48 55.25,31.75 55.24,31.75 53.34,29.84 42.55,29.84 40.64,31.75 | 55.25,33.48 55.25,34.12 | 55.25,33.48 55.25,34.77 | 2.86,44.13 2.54,44.45 | 3.17,58.42 | 3.17,58.42 2.6,57.85 3.17,58.42 | 2.54,56.2 2.54,56.52 | 2.54,56.52 2.54,57.78 | 3.17,58.42 | 2.54,57.78 3.17,58.42 | 2.54,56.52 2.54,57.78
N$74  (via drill 0.6 pad 1.78)
  other vias: 5.08,74.93
N$75
  Bottom 0.406: IC1.13 21.77,61.42 21.12,62.08 | 21.12,62.08 20.8,62.4 | X2.13 29.53,72.07 25.08,72.07 23.81,70.8 20.32,67.31 20.32,64.77 20.32,62.88 21.12,62.08
N$76
  Bottom 0.406: 15.93,60.77 19.18,57.52 IC1.7 | 15.93,60.77 15.24,61.46 | X2.3 13.65,68.9 13.65,63.18 13.65,63.05 15.93,60.77
N$77  (via drill 0.6 pad 1.78)
  other vias: 66.04,65.41
N$78  (via drill 0.6 pad 1.78)
  other vias: 66.04,14.61
N$79  (via drill 0.6 pad 1.78)
  other vias: 5.08,5.08
N$80  (via drill 0.6 pad 1.78)
  other vias: 25.72,50.16
N$81  (via drill 0.6 pad 1.78)
  other vias: 27.62,14.61
N$82  (via drill 0.6 pad 1.78)
  other vias: 27.62,30.16
N$83  (via drill 0.6 pad 1.78)
  other vias: 49.85,40.32
N$84  (via drill 0.6 pad 1.78)
  other vias: 65.09,40.32
N$85
  Bottom 1.016: 62.55,40.96 63.82,42.23
N$86
  Bottom 1.016: 24.77,67.63 25.08,67.63 26.35,68.9 31.43,68.9 31.43,66.67 31.43,66.36 31.11,66.04 31.11,67.94 30.8,68.26 26.67,68.26 26.04,68.26 25.72,67.94 26.04,67.94 26.35,67.63

### Text on the board
Bottom: SMD V. 1 | BLINKEN | DINGS